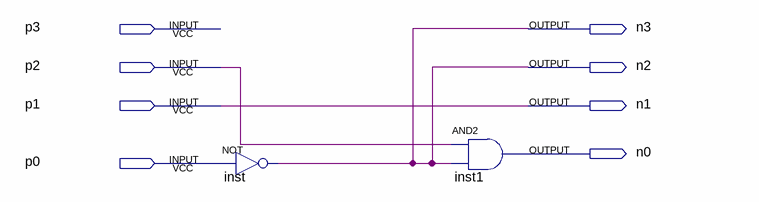
[diagram p0: schematic sheet]
// Quartus schematic Rotation.bdf as structural Verilog: 2 symbols, 8 pins
module Rotation (
  input  p3,
  input  p2,
  input  p1,
  input  p0,
  output n3,
  output n2,
  output n1,
  output n0
);

  not inst (n2, p0);
  and inst1 (n0, p2, n2);

  assign n1 = p1;
  assign n3 = n2;
endmodule
